# EAGLE design Virulent_HW (EAGLE 6.5.0)
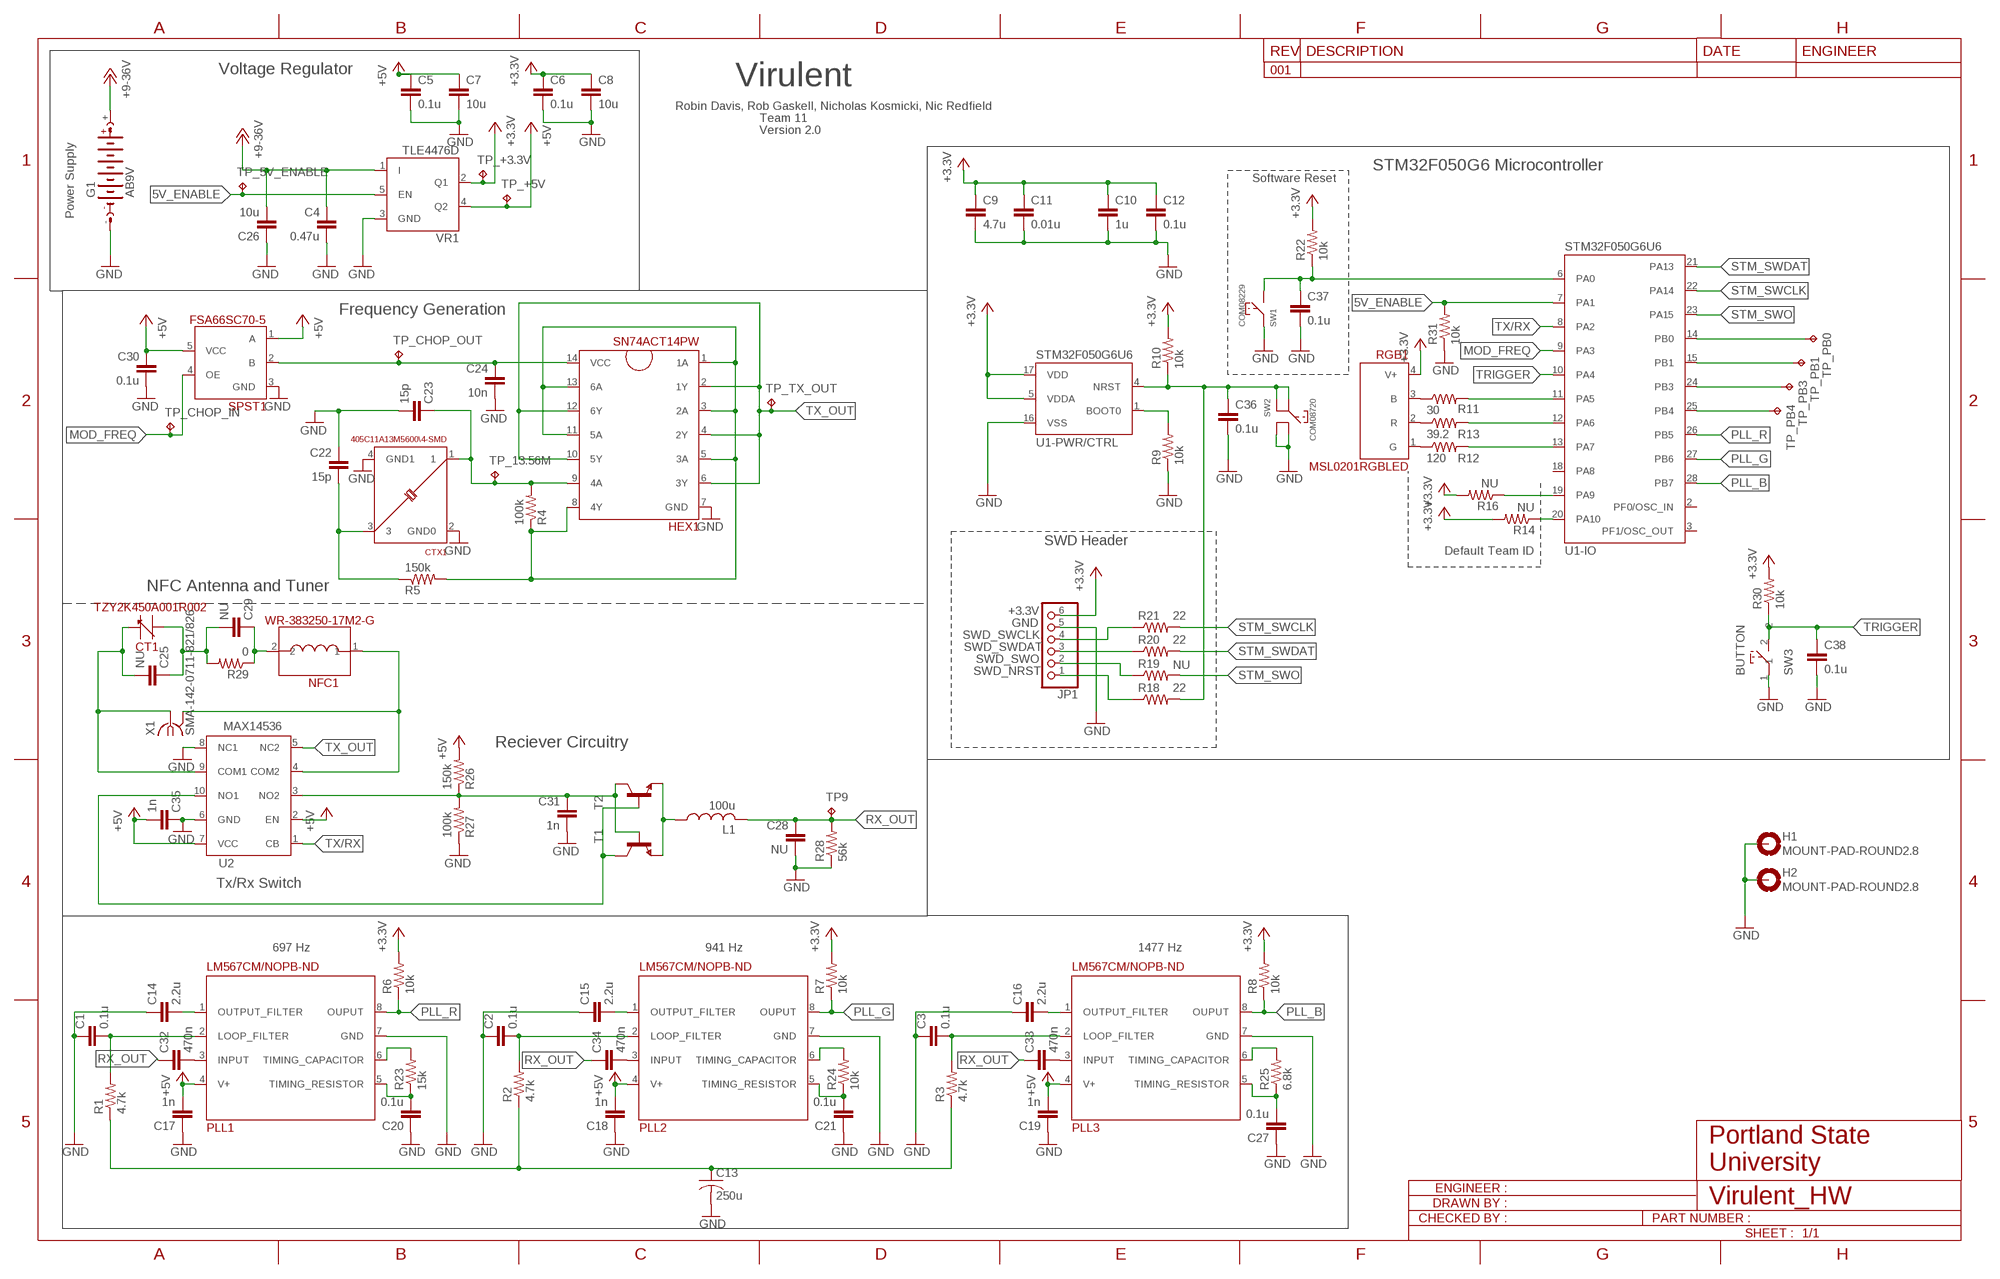
[diagram p0: schematic, sheet 1]

## Parts
C1  0.1u  C-EUC0402  [C0402]
C2  0.1u  C-EUC0402  [C0402]
C3  0.1u  C-EUC0402  [C0402]
C4  0.47u  C-EUC1206  [C1206]
C5  0.1u  C-EUC0402  [C0402]
C6  0.1u  C-EUC0402  [C0402]
C7  10u  C-EUC1206  [C1206]
C8  10u  C-EUC1206  [C1206]
C9  4.7u  C-EUC0805  [C0805]
C10  1u  C-EUC0805  [C0805]
C11  0.01u  C-EUC0402  [C0402]
C12  0.1u  C-EUC0402  [C0402]
C13  250u  C-USC1210  [C1210]
C14  2.2u  C-EUC0402  [C0402]
C15  2.2u  C-EUC0402  [C0402]
C16  2.2u  C-EUC0402  [C0402]
C17  1n  C-EUC0402  [C0402]
C18  1n  C-EUC0402  [C0402]
C19  1n  C-EUC0402  [C0402]
C20  0.1u  C-EUC0402  [C0402]
C21  0.1u  C-EUC0402  [C0402]
C22  15p  C-EUC0402  [C0402]
C23  15p  C-EUC0402  [C0402]
C24  10n  C-EUC0402  [C0402]
C25  NU  C-EUC0402  [C0402]
C26  10u  C-EUC1206  [C1206]
C27  0.1u  C-EUC0402  [C0402]
C28  NU  C-EUC0402  [C0402]
C29  NU  C-EUC0402  [C0402]
C30  0.1u  C-EUC0402  [C0402]
C31  1n  C-EUC0402  [C0402]
C32  470n  C-EUC0402  [C0402]
C33  470n  C-EUC0402  [C0402]
C34  470n  C-EUC0402  [C0402]
C35  1n  C-EUC0402  [C0402]
C36  0.1u  C-EUC0603  [C0603]
C37  0.1u  C-EUC0603  [C0603]
C38  0.1u  C-EUC0603  [C0603]
CT1  TZY2K450A001R002  [TZY2]
CTX1  405C11A13M5600\4-SMD  [4-SMD]
G1  AB9V  [AB9V]
H1  MOUNT-PAD-ROUND2.8  [2,8-PAD]
H2  MOUNT-PAD-ROUND2.8  [2,8-PAD]
HEX1  SN74ACT14PW  [TSSOP14]
JP1  PINHD-1X6  [1X06]
L1  100u  L-USL1008  [L1008]
NFC1  WR-383250-17M2-G  [17M2-G]
PLL1  LM567CM/NOPB-ND  [SOIC-8]
PLL2  LM567CM/NOPB-ND  [SOIC-8]
PLL3  LM567CM/NOPB-ND  [SOIC-8]
R1  4.7k  R-US_R0402  [R0402]
R2  4.7k  R-US_R0402  [R0402]
R3  4.7k  R-US_R0402  [R0402]
R4  100k  R-US_R0402  [R0402]
R5  150k  R-US_R0402  [R0402]
R6  10k  R-US_R0402  [R0402]
R7  10k  R-US_R0402  [R0402]
R8  10k  R-US_R0402  [R0402]
R9  10k  R-US_R0402  [R0402]
R10  10k  R-US_R0402  [R0402]
R11  30  R-US_R0402  [R0402]
R12  120  R-US_R0402  [R0402]
R13  39.2  R-US_R0402  [R0402]
R14  NU  R-US_R0402  [R0402]
R16  NU  R-US_R0402  [R0402]
R18  22  R-US_R0402  [R0402]
R19  NU  R-US_R0402  [R0402]
R20  22  R-US_R0402  [R0402]
R21  22  R-US_R0402  [R0402]
R22  10k  R-US_R0402  [R0402]
R23  15k  R-US_R0402  [R0402]
R24  10k  R-US_R0402  [R0402]
R25  6.8k  R-US_R0402  [R0402]
R26  150k  R-US_R0402  [R0402]
R27  100k  R-US_R0402  [R0402]
R28  56k  R-US_R0402  [R0402]
R29  0  R-US_R0402  [R0402]
R30  10k  R-US_R0402  [R0402]
R31  10k  R-US_R0402  [R0402]
RGB1  MSL0201RGBLED  [MSL0201RGB]
SPST1  FSA66SC70-5  [6-TSSOP]
SW1  COM08229  [COM08229]
SW2  COM08720  [COM08720]
SW3  BUTTON  [17M2-G]
T1  2N2222-NPN-TO18-EBC  [TO18]
T2  2N2222-NPN-TO18-EBC  [TO18]
TP9  TPTP06SQ  [TP06SQ]
TP_5V_ENABLE  TPTP06SQ  [TP06SQ]
TP_13.56M  TPTP06SQ  [TP06SQ]
TP_+3.3V  TPTP06SQ  [TP06SQ]
TP_+5V  TPTP06SQ  [TP06SQ]
TP_CHOP_IN  TPTP06SQ  [TP06SQ]
TP_CHOP_OUT  TPTP06SQ  [TP06SQ]
TP_PB0  TPTP06SQ  [TP06SQ]
TP_PB1  TPTP06SQ  [TP06SQ]
TP_PB3  TPTP06SQ  [TP06SQ]
TP_PB4  TPTP06SQ  [TP06SQ]
TP_TX_OUT  TPTP06SQ  [TP06SQ]
U1  STM32F050G6U6  [UQFPN-28]
U2  MAX14536  [10UTQFN]
VR1  TLE4476D  [PG-TO252-5-11]
X1  SMA-142-0711-821/826  [J502-ND-142-0711-821/826]

## Nets
5V_ENABLE: R31.2 TP_5V_ENABLE.TP U1.7(-IO:PA1) VR1.5(EN)
+2V: C31.1 R26.1 R27.2 T1.3(C) T2.2(B) U2.3(NO2)
+3.3V: C6.1 C8.1 C9.1 C10.1 C11.1 C12.1 JP1.6 R6.2 R7.2 R8.2 R10.2 R14.2 R16.2 R22.2 R30.2 RGB1.4(V+) TP_+3.3V.TP U1.5(-PWR/CTRL:VDDA) U1.17(-PWR/CTRL:VDD) VR1.2(Q1)
+5V: C5.1 C7.1 C17.2 C18.2 C19.2 C30.1 C35.2 PLL1.4(V+) PLL2.4(V+) PLL3.4(V+) R26.2 SPST1.1(A) SPST1.5(VCC) TP_+5V.TP U2.2(EN) U2.7(VCC) VR1.4(Q2)
+9-36V: C4.1 C26.2 G1.+ VR1.1(I)
CHOPPED_FREQ: C24.1 HEX1.14(VCC) SPST1.2(B) TP_CHOP_OUT.TP
GND: C1.1 C2.1 C3.1 C4.2 C5.2 C6.2 C7.2 C8.2 C9.2 C10.2 C11.2 C12.2 C13.2 C14.1 C15.1 C16.1 C17.1 C18.1 C19.1 C20.1 C21.1 C22.1 C23.2 C24.2 C26.1 C27.1 C28.2 C30.2 C31.2 C35.1 C36.2 C37.2 C38.2 CTX1.2(GND0) CTX1.4(GND1) G1.- H1.B2,8(MOUNT) H2.B2,8(MOUNT) HEX1.7(GND) JP1.5 PLL1.7(GND) PLL2.7(GND) PLL3.7(GND) R9.1 R27.1 R28.1 R31.1 SPST1.3(GND) SW1.1 SW2.3 SW2.4 SW3.1 U1.16(-PWR/CTRL:VSS) U2.6(GND) U2.8(NC1) VR1.3(GND)
MOD_FREQ: SPST1.4(OE) TP_CHOP_IN.TP U1.9(-IO:PA3)
N$1: C1.2 PLL1.2(LOOP_FILTER) R1.2
N$2: C2.2 PLL2.2(LOOP_FILTER) R2.2
N$3: C3.2 PLL3.2(LOOP_FILTER) R3.2
N$4: C13.1 R1.1 R2.1 R3.1
N$5: C14.2 PLL1.1(OUTPUT_FILTER)
N$6: C36.1 R10.1 R18.2 SW2.1 SW2.2 U1.4(-PWR/CTRL:NRST)
N$7: C16.2 PLL3.1(OUTPUT_FILTER)
N$8: C20.2 PLL1.5(TIMING_RESISTOR) R23.1
N$9: R9.2 U1.1(-PWR/CTRL:BOOT0)
N$10: C15.2 PLL2.1(OUTPUT_FILTER)
N$12: C21.2 PLL2.5(TIMING_RESISTOR) R24.1
N$13: PLL1.6(TIMING_CAPACITOR) R23.2
N$14: PLL2.6(TIMING_CAPACITOR) R24.2
N$16: C32.2 PLL1.3(INPUT)
N$17: C27.2 PLL3.5(TIMING_RESISTOR) R25.1
N$18: C23.1 CTX1.1 HEX1.9(4A) R4.2 TP_13.56M.TP
N$20: C25.2 CT1.2(B) U2.9(COM1) X1.1
N$21: R11.1 RGB1.3(B)
N$22: T1.2(B) T2.3(C) U2.10(NO1)
N$23: C34.2 PLL2.3(INPUT)
N$24: HEX1.1(1A) HEX1.3(2A) HEX1.5(3A) HEX1.8(4Y) HEX1.11(5A) HEX1.13(6A) R4.1 R5.2
N$25: C33.2 PLL3.3(INPUT)
N$26: C25.1 C29.2 CT1.1(A) R29.2
N$27: PLL3.6(TIMING_CAPACITOR) R25.2
N$28: R11.2 U1.11(-IO:PA5)
N$29: R13.2 U1.12(-IO:PA6)
N$30: C29.1 NFC1.2 R29.1
N$31: R12.2 U1.13(-IO:PA7)
N$32: NFC1.1 U2.4(COM2) X1.G@1 X1.G@2 X1.G@3 X1.G@4
N$33: C22.2 CTX1.3 R5.1
N$34: R16.1 U1.19(-IO:PA9)
N$35: R12.1 RGB1.1(G)
N$36: R13.1 RGB1.2(R)
N$41: TP_PB4.TP U1.25(-IO:PB4)
NRESET_SOFT: C37.1 R22.1 SW1.2 U1.6(-IO:PA0)
PB0: TP_PB0.TP U1.14(-IO:PB0)
PB1: TP_PB1.TP U1.15(-IO:PB1)
PB3: TP_PB3.TP U1.24(-IO:PB3)
PLL_B: PLL3.8(OUPUT) R8.1 U1.28(-IO:PB7)
PLL_G: PLL2.8(OUPUT) R7.1 U1.27(-IO:PB6)
PLL_R: PLL1.8(OUPUT) R6.1 U1.26(-IO:PB5)
RX_OUT: C28.1 C32.1 C33.1 C34.1 L1.2 R28.2 TP9.TP
RX_OUT_L: L1.1 T1.1(E) T2.1(E)
STM_SWCLK: R21.2 U1.22(-IO:PA14)
STM_SWDAT: R20.2 U1.21(-IO:PA13)
STM_SWO: R19.2 U1.23(-IO:PA15)
SWD_NRST: JP1.1 R18.1
SWD_SWCLK: JP1.4 R21.1
SWD_SWDAT: JP1.3 R20.1
SWD_SWO: JP1.2 R19.1
TEAMID1: R14.1 U1.20(-IO:PA10)
TRIGGER: C38.1 R30.1 SW3.2 U1.10(-IO:PA4)
TX/RX: U1.8(-IO:PA2) U2.1(CB)
TX_OUT: HEX1.2(1Y) HEX1.4(2Y) HEX1.6(3Y) HEX1.10(5Y) HEX1.12(6Y) TP_TX_OUT.TP U2.5(NC2)
Unconnected: U1.2(-IO:PF0/OSC_IN) U1.3(-IO:PF1/OSC_OUT) U1.18(-IO:PA8)

## Notes on the sheet
- Voltage Regulator
- Virulent
- Robin Davis, Rob Gaskell, Nicholas Kosmicki, Nic Redfield
- Team 11
- Version 2.0
- STM32F050G6 Microcontroller
- Software Reset
- Power Supply
- Frequency Generation
- SWD Header
- Default Team ID
- NFC Antenna and Tuner
- Reciever Circuitry
- Tx/Rx Switch
- 697 Hz | 941 Hz | 1477 Hz

## Library data of the parts
C1-C12 C14-C38 = rcl:C-EU: CAPACITOR, European symbol
C13 = rcl:C-US: CAPACITOR, American symbol
CT1 = Virulent_HW:TZY2K450A001R00
CTX1 = Virulent_HW:405C11A13M5600
G1 = battery:AB9V: 9-V BATTERY CLIP
H1 H2 = holes:MOUNT-PAD-ROUND: MOUNTING PAD, round
HEX1 = Virulent_HW:SN74ACT14
JP1 = Virulent_HW:PINHD-1X6: PIN HEADER
L1 = rcl:L-US: INDUCTOR, American symbol
NFC1 = Virulent_HW:WR-383250
PLL1-PLL3 = Virulent_HW:LM567CM
R1-R14 R16 R18-R31 = Virulent_HW:R-US_: RESISTOR, American symbol
RGB1 = Virulent_HW:MSL0201RGB
SPST1 = Virulent_HW:FSA66
SW1 = Virulent_HW:COM08229
SW2 = Virulent_HW:COM08720
SW3 = Virulent_HW:BUTTON
T1 T2 = transistor:*-NPN-: NPN Transistror BF959 corrected 2008.03.06
TP9 TP_5V_ENABLE TP_13.56M TP_+3.3V TP_+5V TP_CHOP_IN TP_CHOP_OUT TP_PB0 TP_PB1 TP_PB3 TP_PB4 TP_TX_OUT = testpad:TP: Test pad
U1 = Virulent_HW:STM32F050G6
U2 = Virulent_HW:MAX14536
VR1 = motorFeedback:TLE4476
X1 = con-coax:SMA-: SMA 50 Ohm End Launch Jack Receptacle - Round Contact Johnson Components Source: www.johnsoncomponents.com .. J502-ND.pdf; MF: JOHNSON COMPONENTS; MPN: 142-0711-821; OC_FARNELL: 1019328; OC_NEWARK: 16F3627

## Board
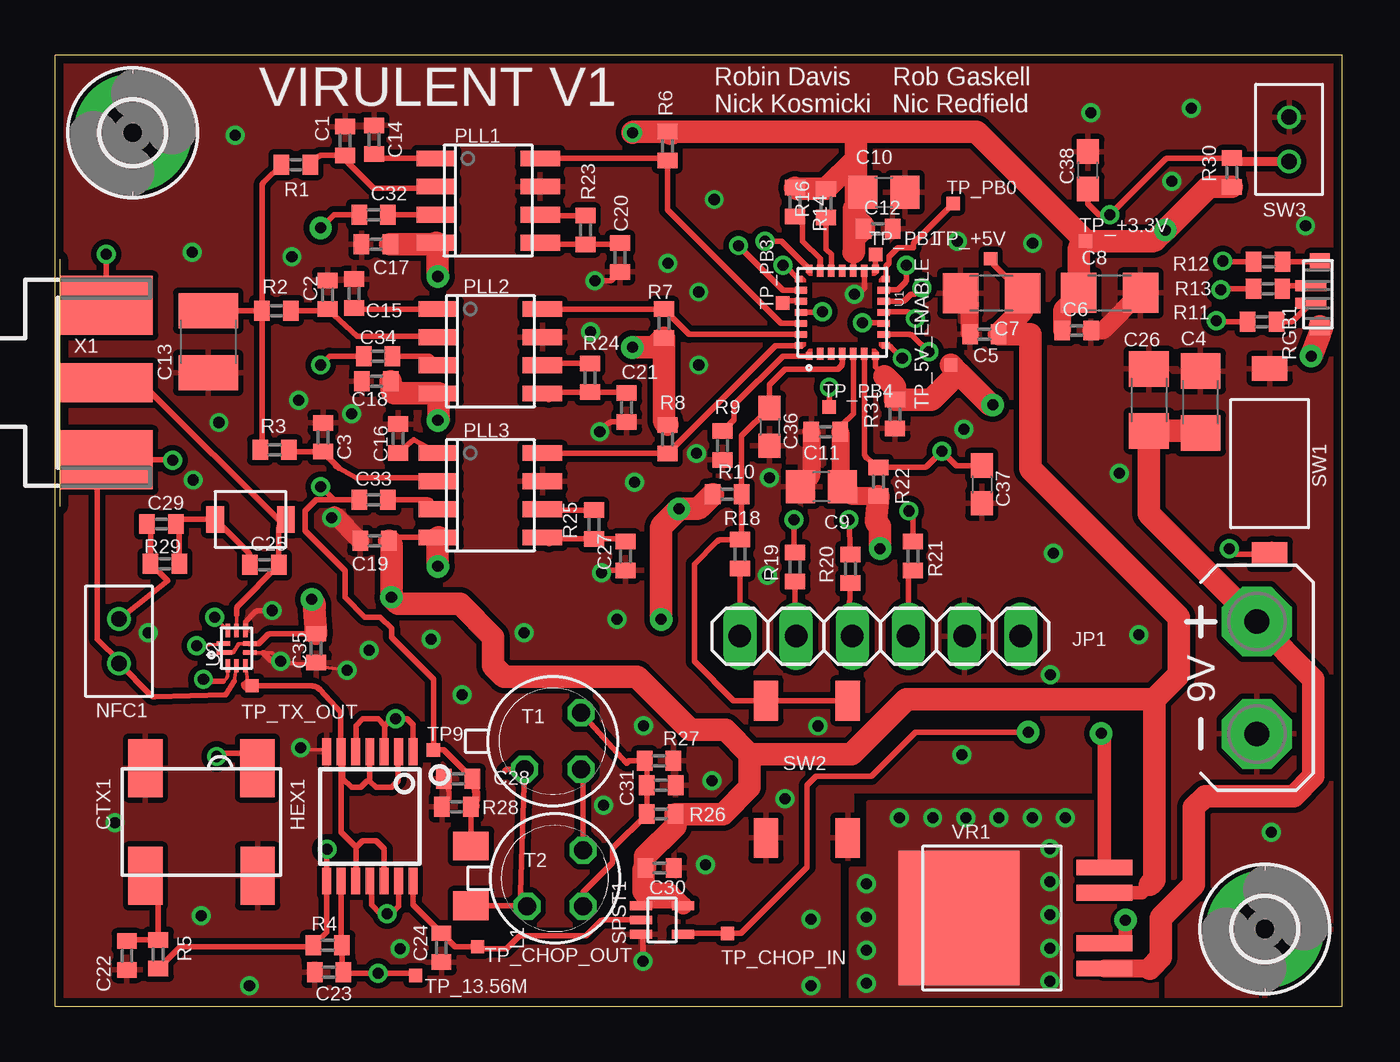
[diagram p1: board, top side]
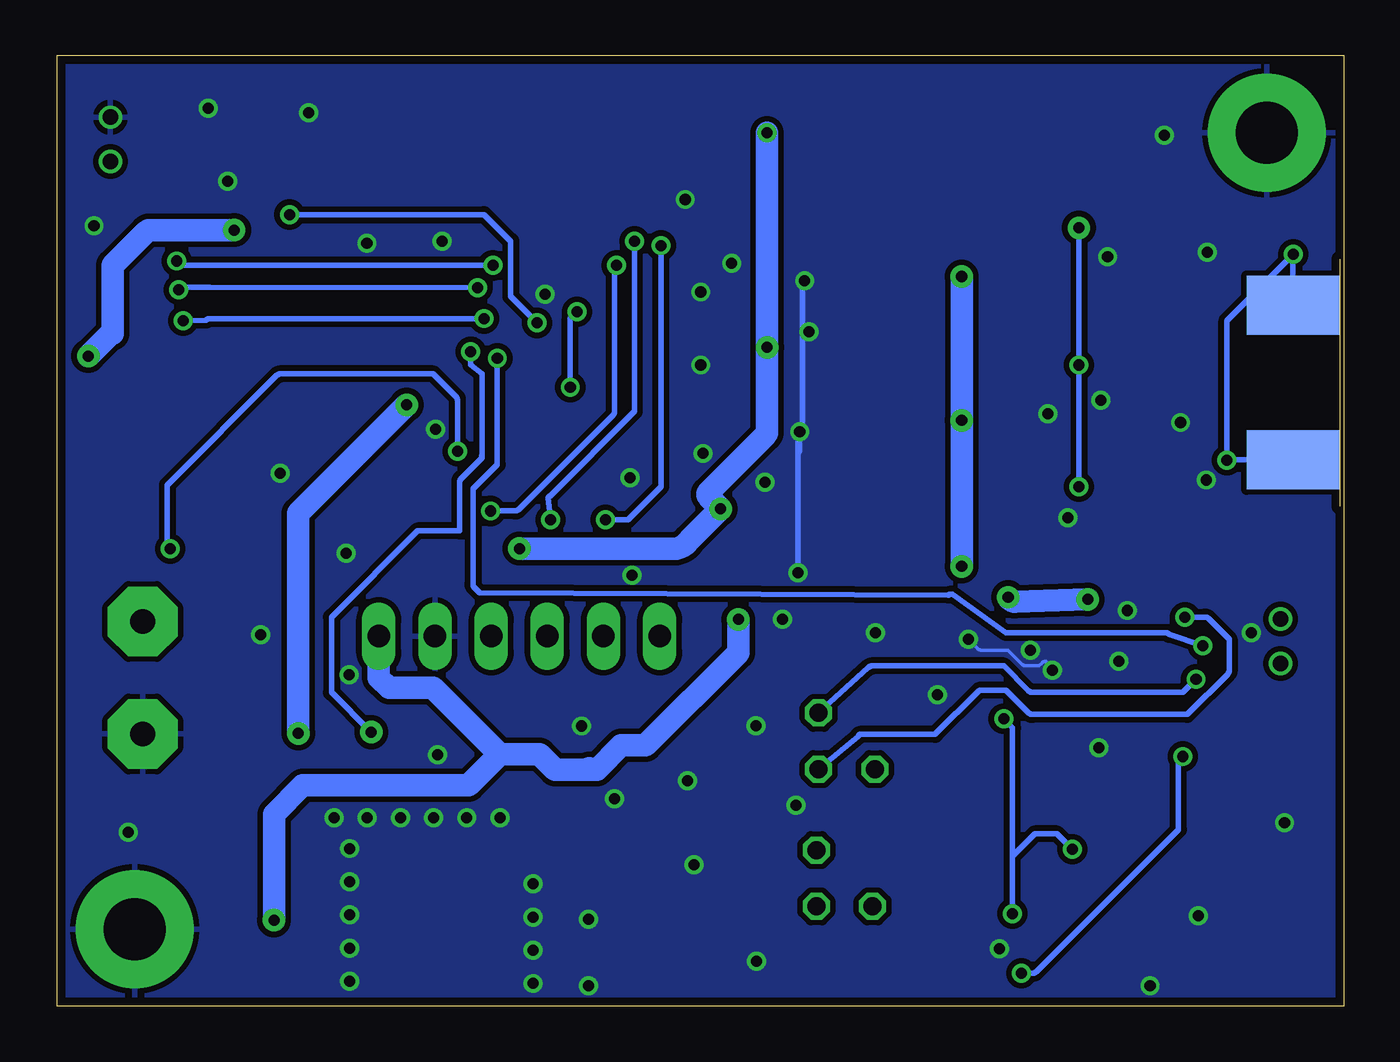
[diagram p2: board, bottom side, seen from below]

Size 58.2 x 43 mm. Coordinates in mm from the lower left corner, seen from the top.
Outline: 0,0 58.2,0 58.2,43 0,43 0,0
Copper layers (1*16): Top 0.0356mm / dielectric 1.5011mm / Bottom 0.0356mm
Design rules "LaenPCBOrder *": minimum track width 6mil, minimum drill 13mil, track to track 6mil, track to pad 6mil, pad to pad 6mil, via to via 6mil, smd to smd 6mil, copper to edge 15mil, drill to drill 6mil, minimum pad ring 7mil, minimum via ring 7mil, stop-mask expansion 3mil, vias tented up to drill 20mil, thermal gap 10mil

### Footprints (pad centres in the part's own frame; a part is rotated, then mirrored left to right if it is on the bottom)
C0402 = smd 0.7 x 0.9: 1 -0.65,0; 2 0.65,0
C1206 = smd 1.6 x 1.8: 1 -1.4,0; 2 1.4,0
C0805 = smd 1.3 x 1.5: 1 -0.95,0; 2 0.95,0
C1210 = smd 1.6 x 2.7: 1 -1.4,0; 2 1.4,0
C0603 = smd 1.1 x 1: 1 -0.85,0; 2 0.85,0
TZY2 = smd 0.8 x 1.2: 1 -1.6,0; 2 1.6,0
4-SMD = smd 1.55 x 2.618: 1 -2.535,-2.438; 2 2.535,-2.438; 3 2.535,2.438; 4 -2.54,2.438
AB9V = drill 1.118 pad 3.15 octagon: + 0,2.54; - 0,-2.54
2,8-PAD = drill 2.8 pad 5.334: B2,8 0,0
TSSOP14 = smd 0.4 x 1.2: 1 -2.275,-2.925; 2 -1.625,-2.925; 3 -0.975,-2.925; 4 -0.325,-2.925; 5 0.325,-2.925; 6 0.975,-2.925; 7 1.625,-2.925; 8 1.625,2.925; 9 0.975,2.925; 10 0.325,2.925; 11 -0.325,2.925; 12 -0.975,2.925; 13 -1.625,2.925; 14 -2.275,2.925
1X06 = drill 1.016 long: 1 -6.35,0; 2 -3.81,0; 3 -1.27,0; 4 1.27,0; 5 3.81,0; 6 6.35,0
L1008 = smd 1.3 x 1.6: 1 -1.35,0; 2 1.35,0
17M2-G = drill 0.7: 1 0,1; 2 0,-1
SOIC-8 = smd 0.711 x 1.778: 1 -1.905,-2.349; 2 -0.635,-2.349; 3 0.635,-2.349; 4 1.905,-2.349; 5 1.905,2.349; 6 0.635,2.349; 7 -0.635,2.349; 8 -1.905,2.349
R0402 = smd 0.7 x 0.9: 1 -0.65,0; 2 0.65,0
MSL0201RGB = smd 0.9 x 0.8: 1 -0.075,-1.45; 4 -0.075,1.45 | smd 1.4 x 0.5: 2 0.325,-0.4; 3 0.325,0.4
6-TSSOP = smd 1 x 0.4: 1 -0.95,0.65; 2 -0.95,0; 3 -0.95,-0.65; 4 0.95,-0.65; 5 0.95,0.65
COM08229 = smd 1.1 x 1.6: 1 -4.2,0; 2 4.2,0
COM08720 = smd 1.8 x 1.1: 1 -3.1,1.85; 2 -3.1,-1.85; 3 3.1,1.85; 4 3.1,-1.85
TO18 = drill 0.813 octagon: 1 -1.27,-1.27; 2 1.27,-1.27; 3 1.27,1.27
TP06SQ = smd 0.6 x 0.6: TP 0,0
UQFPN-28 = smd 0.35 x 0.3: 1 -1.975,1.5; 7 -1.975,-1.5; 15 1.975,-1.5; 21 1.975,1.5 | smd 0.55 x 0.3: 2 -1.875,1; 3 -1.875,0.5; 4 -1.875,0; 5 -1.875,-0.5; 6 -1.875,-1; 16 1.875,-1; 17 1.875,-0.5; 18 1.875,0; 19 1.875,0.5; 20 1.875,1 | smd 0.3 x 0.35: 8 -1.5,-1.975; 14 1.5,-1.975; 22 1.5,1.975; 28 -1.5,1.975 | smd 0.3 x 0.55: 9 -1,-1.875; 10 -0.5,-1.875; 11 0,-1.875; 12 0.5,-1.875; 13 1,-1.875; 23 1,1.875; 24 0.5,1.875; 25 0,1.875; 26 -0.5,1.875; 27 -1,1.875
10UTQFN = smd 0.2 x 0.6: 1 0.2,0.6; 6 -0.2,-0.6; 7 0.2,-0.6 | smd 0.2 x 0.7: 2 -0.2,0.55 | smd 0.6 x 0.2: 3 -0.8,0.4; 4 -0.8,0; 5 -0.8,-0.4; 8 0.8,-0.4; 9 0.8,0; 10 0.8,0.4
PG-TO252-5-11 = smd 0.711 x 2.54: 1 -2.286,-5.08; 2 -1.143,-5.08; 4 1.143,-5.08; 5 2.286,-5.08 | smd 6.096 x 5.461: 3 0,1.499
J502-ND-142-0711-821/826 = smd 4.191 x 1.778: 1 2.115,0 | smd 4.191 x 2.667: G@1 2.115,3.495; G@2 2.115,-3.495 | smd 4.191 x 2.667 bottom: G@3 2.115,3.495; G@4 2.115,-3.495

### Placement (x,y rotation side)
C1  13.11,39.13 270 top
C2  12.31,32.18 270 top
C3  12.11,25.73 270 top
C4  51.79,27.32 90 top
C5  42.02,30.39 180 top
C6  46.19,30.56 0 top
C7  42.34,32.24 180 top
C8  47.68,32.26 0 top
C9  34.65,23.49 180 top
C10  37.47,36.81 0 top
C11  34.84,25.99 180 top
C12  37.21,35.16 0 top
C13  6.92,30.05 270 top
C14  14.41,39.18 270 top
C15  13.51,32.23 270 top
C16  15.51,25.68 270 top
C17  14.5,34.46 0 top
C18  14.52,28.26 0 top
C19  14.44,21.06 0 top
C20  25.54,33.86 90 top
C21  25.84,27.08 90 top
C22  3.24,2.3 90 top
C23  12.38,1.54 180 top
C24  17.46,2.66 270 top
C25  9.46,19.96 0 top
C26  49.46,27.42 270 top
C27  25.79,20.36 90 top
C28  18.22,10.29 180 top
C29  4.8,21.81 0 top
C30  27.33,6.26 0 top
C31  27.4,10 0 top
C32  14.4,35.8 0 top
C33  14.4,22.9 0 top
C34  14.6,29.4 0 top
C35  11.8,16.2 90 top
C36  32.3,26.2 270 top
C37  41.9,23.6 270 top
C38  46.7,37.8 90 top
CT1  8.83,22.02 0 top
CTX1  6.61,8.34 180 top
G1  54.34,14.86 0 top
H1  54.7,3.5 0 top
H2  3.5,39.5 0 top
HEX1  13.9,8.59 180 top
JP1  37.31,16.74 0 top
L1  18.8,5.9 90 top
NFC1  2.88,16.51 180 top
PLL1  19.58,36.43 270 top
PLL2  19.68,29.62 270 top
PLL3  19.68,23.11 270 top
R1  10.88,38.06 0 top
R2  10,31.46 0 top
R3  9.92,25.16 0 top
R4  12.32,2.76 0 top
R5  4.66,2.36 270 top
R6  27.68,38.9 90 top
R7  27.52,30.88 270 top
R8  27.68,25.64 90 top
R9  30.18,25.36 90 top
R10  30.39,23.16 180 top
R11  54.57,30.96 180 top
R12  54.85,33.66 180 top
R13  54.84,32.44 180 top
R14  33.46,36.37 90 top
R16  34.86,36.31 90 top
R18  30.96,20.45 90 top
R19  33.46,19.87 90 top
R20  35.96,19.79 90 top
R21  38.78,20.36 90 top
R22  37.22,23.72 270 top
R23  23.98,35.1 90 top
R24  24.18,28.42 90 top
R25  24.36,21.79 90 top
R26  27.4,8.7 0 top
R27  27.3,11.1 180 top
R28  18.14,9.02 0 top
R29  4.96,20.02 0 top
R30  53.2,37.7 270 top
R31  37.98,26.78 90 top
RGB1  57.11,32.19 180 top
SPST1  27.44,3.91 0 top
SW1  54.92,24.64 270 top
SW2  33.99,10.72 270 top
SW3  55.8,39.2 0 top
T1  22.5,12 0 top
T2  22.6,5.8 0 top
TP9  17.1,11.6 0 top
TP_5V_ENABLE  40.5,29 0 top
TP_13.56M  16.3,1.4 0 top
TP_+3.3V  46.6,34.6 0 top
TP_+5V  42.3,33.8 0 top
TP_CHOP_IN  30.4,3.3 0 top
TP_CHOP_OUT  19.1,2.7 0 top
TP_PB0  40.6,36.3 0 top
TP_PB1  37.1,34 0 top
TP_PB3  32.9,31.8 90 top
TP_PB4  35,27.1 0 top
TP_TX_OUT  8.9,14.5 0 top
U1  35.59,31.38 90 top
U2  8.2,16.2 90 top
VR1  42.37,4 90 top
X1  0.2,28.2 0 top

### Tracks (layer width: path | path; a pad name or v marks a point on that pad's centre or on a via)
5V_ENABLE  (via drill 0.5 pad 1.02)
  Top 0.254: U1.7 37.09,28.91 37.5,28.5
  Top 0.61: VR1.5 47.45,12.2 v47.3,12.35
  Top 1.016: v42.4,27.2 42.3,27.2 40.85,28.65 | 40.85,28.65 TP_5V_ENABLE.TP | 40.85,28.65 39.63,27.43 R31.2 37.98,28.02 37.5,28.5
  Bottom 1.016: v47.3,12.35 47.3,22.3 v42.4,27.2
+2V  (via drill 0.5)
  Top 0.16: U2.3 7.8,15.01 arc-45 7.73,14.83 7.6,14.7
  Top 0.254: T1.3 25.84,11 25.94,11.1 R27.2 26.75,10.9 C31.1 R26.1 25.2,7.15 25.2,6.5 23.87,5.17 T2.2 | 7.6,14.7 6.91,14.7 arc-45 6.73,14.77 v6.7,14.8
  Bottom 0.254: v6.7,14.8 7.3,14.2 14.1,14.2 arc45 14.27,14.27 15.4,15.4 21.34,15.4 arc-45 21.51,15.33 T1.3 23.47,13.17 arc-45 23.3,13.1
+3.3V  (via drill 0.5, 0.5 pad 1.02)
  Top 0.254: U1.5 arc-45 36.1,29.48 36.1,26.8 35.56,26.26 arc45 35.49,26.09 C11.1 arc-45 35.5,25.97 | U1.17 36.09,34.09 36.1,34.1
  Top 0.61: VR1.2 48.4,2.86 v48.4,3.9
  Top 0.813: C6.1 45.54,31.41 arc-45 45.61,31.59 C8.1 46.28,34.27 arc-45 46.35,34.45 | 46.28,34.17 arc-45 46.35,34.35 | R22.2 36.12,23.07 arc-45 35.95,23.14 C9.1 35.57,23.52 arc-45 35.5,23.7 35.5,25.97
  Top 1.016: 36.12,35.9 C10.1 | 27.88,39.46 arc-45 27.7,39.53 R6.2 | v27.4,17.5 27.4,21.59 arc-45 27.47,21.77 v28.2,22.5 28.98,22.5 arc45 29.15,22.57 R10.2 | v37.3,20.7 37.3,21.7 37.19,21.81 arc-45 37.12,21.98 R22.2 | v26.1,29.8 26.98,29.8 arc45 27.16,29.87 R7.2 27.52,26.55 arc45 27.59,26.38 R8.2 | 46.28,34.17 arc-45 46.35,34.35 | C8.1 46.28,34.17 | 46.28,34.17 arc-45 46.35,34.35 | 46.35,34.35 TP_+3.3V.TP | TP_+3.3V.TP 49.59,34.6 arc45 49.77,34.67 v50.2,35.1 52.08,36.98 arc-45 52.26,37.05 R30.2 | v56.8,29.4 57.2,30.45 arc-45 57.27,30.63 57.19,30.72 RGB1.4 | R6.2 26.22,39.55 arc45 v26.1,39.5 | 36.12,35.9 36.12,35.7 | 36.12,35.7 36.12,34.12 36.1,34.1 | 36.46,35.16 36.2,34.9 36.3,34.9 C12.1 36.56,35.26 36.12,35.7 | TP_+3.3V.TP 41.65,39.55 36.2,39.55 | 36.2,39.55 R6.2 | 36.2,38.3 36.2,36.15 36.12,36.07 36.12,35.9 | 36.2,38.3 36.2,39.55 | R14.2 33.52,36.96 R16.2 36.2,38.3
  Bottom 1.016: 43.59,15.79 arc45 43.66,15.96 JP1.6 43.66,14.86 43.2,14.4 41.2,14.4 38.2,11.4 | 34.13,10.77 arc45 34.3,10.7 | v37.3,20.7 30.2,20.7 arc-45 29.63,21.07 v28.2,22.5 28.73,23.03 arc45 28.8,23.2 26.17,25.83 arc-45 26.1,26.01 v26.1,29.8 v26.1,39.5 | v50.2,35.1 53.99,35.1 arc-45 54.17,35.03 55.7,33.5 55.7,30.41 arc-45 55.86,30.34 v56.8,29.4 | v27.4,17.5 27.4,16 31.6,11.8 32.7,11.8 33.8,10.7 34.3,10.7 | 34.3,10.7 35.7,10.7 36.4,11.4 38.2,11.4 | 38.2,11.4 39.6,10 47.1,10 48.4,8.7 v48.4,3.9
+5V  (via drill 0.5 pad 1.02)
  Top 0.16: 8,16 U2.2 8.05,16 8.3,16.4 U2.7
  Top 0.254: C19.2 15.16,21.13 arc-45 15.34,21.2 PLL3.4 17.3,21.23 | 43.8,32.38 arc-45 C7.1 42.47,33.51 arc-45 42.4,33.69 TP_+5V.TP | U2.7 9.2,16.4 9.58,16.78 arc-45 9.76,16.85 C35.2 | SPST1.1 SPST1.5
  Top 0.61: VR1.4 49.14,5.14 49.5,5.5
  Top 0.813: SPST1.5 27.85,5.1 27.7,5.1
  Top 1.016: C17.2 17.07,34.46 arc45 PLL1.4 17.3,34.46 v17.3,33 | C18.2 15.24,27.79 arc45 15.42,27.71 PLL2.4 17.33,26.53 v17.3,26.5 | C19.2 15.13,21.02 arc-45 15.2,20.84 v15.2,18.5 15.5,18.2 18.3,18.2 19.8,16.7 19.8,15.4 20.3,14.9 26.3,14.9 28.7,12.5 30.3,12.5 31.4,11.4 | v11.6,18.4 11.73,18.17 arc-45 11.7,18 C35.2 | C7.1 43.74,31.57 arc-45 43.67,31.39 C5.1 44.1,30.39 44.1,24.3 50.8,17.6 50.8,15 49.7,13.9 | v17.3,19.9 17.3,21.17 PLL3.4 | 49.7,13.9 38.5,13.9 36,11.4 31.4,11.4 | 27.7,5.1 26.7,5.1 26.6,5.2 26.6,6.18 C30.1 26.68,6.78 28.05,8.15 R26.2 30.2,8.7 31.4,9.9 31.4,11.4 | 49.7,13.9 49.7,5.7 49.5,5.5
  Bottom 1.016: v15.2,18.5 15.07,18.37 arc-45 14.89,18.3 v11.6,18.4 | v17.3,19.9 v17.3,26.5 v17.3,33
+9-36V
  Top 0.813: 49.5,1.71 VR1.1
  Top 1.016: C4.1 51.69,26.02 C26.2 49.46,22.28 G1.+ 54.34,17.36 56.9,14.8 56.9,10.4 56,9.5 52,9.5 51.5,9 51.5,5.5 50,4 50,2.21 49.5,1.71
CHOPPED_FREQ
  Top 0.254: SPST1.2 24.82,3.91 arc45 24.64,3.84 24,3.2 21.11,3.2 arc45 20.93,3.13 20.4,2.6 19.3,2.6 arc-45 19.13,2.67 TP_CHOP_OUT.TP 18.07,2.7 C24.1 16.18,4.59 HEX1.14
GND  (via drill 0.5)
  Top 0.16: v11.1,11.7 11.1,11.6 12.09,11.6 arc-45 12.26,11.53 HEX1.7 | C35.1 arc-45 11.68,15.5 10.1,15.5 | 9.4,16 U2.6 9.7,16 arc-45 9.87,15.93 v10.2,15.6 v13.2,15.2
  Top 0.254: R28.1 17.79,9.34 arc45 C28.2 | C27.1 24.91,19.71 arc45 24.74,19.64 v24.7,19.6 | v24.4,32.8 25.02,32.8 arc45 25.2,32.87 C20.1 | C21.1 25.19,26.43 arc45 25.01,26.36 v24.63,25.97 | SPST1.3 26.51,3.24 arc-45 26.58,3.06 v26.58,2.04 | 9.4,16 9.73,15.67 arc45 9.9,15.6 v10.2,15.6 | U2.8 8.6,17.4 9.03,17.83 arc-45 9.21,17.9 v9.8,17.9 | U1.16 36.6,32.5 36.3,32.2 v36.14,32.2
  Top 0.813: C6.2 47.27,30.56 arc45 47.45,30.63 C8.2 | C5.2 41.37,31.7 arc45 41.3,31.88 C7.2 | C11.2 34.19,24.09 arc-45 34.12,23.91 C9.2 | C19.1 12.65,22.2 12.6,22.2 v12.5,22.1
  Top 1.016: C26.1 49.49,28.79 arc45 49.66,28.72
  Bottom 0.16: v13.2,15.2 13.49,15.6 arc-45 13.67,15.53 13.8,15.4 14.39,15.4 arc45 14.57,15.47 15.2,16.1 16.39,16.1 arc45 16.57,16.17 v17,16.6
  Bottom 0.254: v24.7,19.6 24.7,25 | 24.7,25 24.7,25.8 arc45 v24.63,25.97 | v24.63,25.97 24.5,26.1 24.5,32.59 arc45 24.43,32.77 v24.4,32.8 | v24.63,25.97 24.63,25.18 arc45 24.7,25
  other vias: 21.2,16.9 26.6,12.7 33,9.4 41,11.38 48.12,24.1 49,16.8 34.18,0.94 8.78,0.94 2.7,8.3 7.4,26.4 6.24,23.8 45.14,20.48 56.54,35.3 50.5,37.3 51.38,40.6 8.14,39.38 29.8,36.48 6.2,34.1 29.1,29 40.8,34.6 44.2,34.5 18.4,14.1 24.8,9.1 6.6,4.1 14.2,16.1 46.84,40.4 11,27.4 13.4,26.8 41.1,26.1 29,25 29.1,32.3 26.2,23.7 29.7,10.2 29.4,6.4 4.2,16.9 27.7,33.6 24.2,30.5 25.4,17.5 45,15 34.5,12.68 32.3,23.9 32.2,19.5 10.7,33.9 36.68,1.04 36.68,2.54 36.68,4.04 36.68,5.54 38.18,8.54 39.68,8.54 41.18,8.54 42.68,8.54 44.18,8.54 45.68,8.54 44.98,7.14 44.98,5.64 44.98,4.14 44.98,2.64 44.98,1.14 34.18,3.94 55,7.88 15.6,2.6
  pour Top (isolate 0.254): 0,0 35.4,0 35.4,6.7 36,6.7 36,9.75 50.3,9.75 50.3,0 58.2,0 58.2,42.9 0,42.9
  pour Bottom (isolate 0.254): 0,0 58.2,0 58.2,42.9 58.2,43 0,43
  pour Top (no thermals): 36,0 49.8,0 49.8,9.2 36.8,9.2 36.8,6.2 36,6.2
MOD_FREQ  (via drill 0.5, 0.5 pad 1.02)
  Top 0.254: SPST1.4 arc-45 28.49,3.3 TP_CHOP_IN.TP 31,3.3 34,6.3 34,10 34.4,10.4 36.9,10.4 38.9,12.4 v44,12.4 | v39.5,29.6 38.79,30.31 arc45 38.62,30.38 U1.9
  Bottom 0.254: v39.5,29.6 39.5,29 39,28.6 39,24.9 arc-90 39,24.8 39.93,23.87 arc-45 40,23.7 40,21.5 41.9,21.5 45.8,17.6 45.8,14.2 v44,12.4
N$1
  Top 0.254: PLL1.2 17.17,37 14.4,37 13.18,38.22 arc-45 13.11,38.4 C1.2 12.05,38.48 arc45 11.88,38.41 R1.2
N$2
  Top 0.254: PLL2.2 17.29,30.3 13.64,30.3 C2.2 12.44,31.46 R2.2
N$3
  Top 0.254: PLL3.2 17.16,23.57 arc-45 16.98,23.9 13.6,23.9 12.84,24.33 | 12.84,24.33 12.68,24.42 | R3.2 R3.2 arc45 10.76,25.08 C3.2 arc45 12.12,25.04 12.84,24.33
N$4
  Top 0.254: R2.1 9.35,25.68 arc45 9.42,25.51 R3.1 | C13.1 9.33,31.45 arc45 R2.1 | R2.1 9.35,37.08 arc-45 9.42,37.25 R1.1
N$5
  Top 0.254: PLL1.1 14.61,38.34 C14.2
N$6
  Top 0.254: U1.4 35.59,29.09 arc-45 35.52,28.92 35.4,28.8 33,28.8 32.3,28.1 C36.1 31.04,25.79 R10.1 31.04,21.18 R18.2 30.11,21.1 arc45 29.93,21.03 28.9,20 28.9,15.6 30.68,13.82 SW2.2 | SW2.1 SW2.2 | 32.14,14.21 SW2.2
N$7
  Top 0.254: C16.2 16.21,25.63 PLL3.1
N$8
  Top 0.254: PLL1.5 22.14,34.31 22.21,34.38 arc-45 22.39,34.45 R23.1 25.39,34.45 arc45 C20.2
N$9
  Top 0.254: U1.1 32.91,29.41 30.7,27.2 30.7,26.53 R9.2
N$10
  Top 0.254: PLL2.1 13.84,31.52 arc-45 C15.2
N$12
  Top 0.254: PLL2.5 22.31,27.43 22.58,27.7 arc-45 22.76,27.77 R24.1 25.54,27.77 arc-45 C21.2
N$13
  Top 0.254: PLL1.6 arc45 22.04,35.75 R23.2
N$14
  Top 0.254: PLL2.6 22.04,29 arc-45 22.22,29.07 R24.2
N$16
  Top 0.254: PLL1.3 C32.2
N$17
  Top 0.254: PLL3.5 22.32,20.91 22.48,21.07 arc-45 22.66,21.14 R25.1 25.36,21.14 arc-45 25.53,21.07 C27.2
N$18  (via drill 0.5)
  Top 0.254: HEX1.9 12.93,2.81 | R4.2 12.97,1.6 | CTX1.1 8.95,11.46 7.56,11.46 arc45 7.38,11.38 v7.3,11.3 | C23.1 13.07,1.5 v14.6,1.5 16.09,1.5 arc-45 16.27,1.43 TP_13.56M.TP
  Top 0.406: 12.93,2.81 R4.2 | 12.97,1.6 C23.1
  Bottom 0.254: v14.6,1.5 14.11,1.5 arc-45 13.93,1.57 7.5,8 7.5,10.99 | 7.5,10.99 arc45 7.43,11.17 v7.3,11.3 7.5,11.1 7.5,10.99
N$20
  Top 0.16: 8.2,17.7 U2.9
  Top 0.254: 10.18,21.77 arc45 10.11,21.59 C25.2 8.27,18.12 arc45 8.2,17.95 8.2,17.7 | 10.18,21.77 CT1.2 | 10.18,21.77 10.18,21.92 4.1,28 2.42,28 X1.1
N$21
  Top 0.254: R11.1 55.85,30.96 arc45 56.03,31.03 RGB1.3
N$22  (via drill 0.5)
  Top 0.16: U2.10 7.3,17.5
  Top 0.254: 7.3,17.5 v7.2,17.6 | T2.3 23.87,10.63 T1.2
  Bottom 0.254: v7.2,17.6 6.3,17.6 arc45 6.13,17.53 5.2,16.6 5.2,15.21 arc45 5.27,15.03 7.1,13.2 14.1,13.2 arc45 14.27,13.27 15.3,14.3 16.39,14.3 arc-45 16.57,14.23 18.5,12.3 21.89,12.3 arc-45 21.97,12.23 T1.2
N$23
  Top 0.254: 17.32,29 PLL2.3 16.99,29.33 arc45 16.81,29.4 C34.2
N$24  (via drill 0.5)
  Top 0.254: HEX1.5 13.6,11.54 13.6,12.7 13.9,13 14.6,13 14.9,12.7 | 14.9,12.7 14.9,11.57 arc-45 HEX1.3 | 14.9,12.7 15.2,13 v15.4,13 15.9,13 16.18,12.72 HEX1.1 | HEX1.13 15.53,4.53 15.2,4.2 v15,4.2 14.7,4.2 14.3,4.6 14.3,5.59 HEX1.11 | R4.1 12.28,3.37 HEX1.8 12.28,7.08 v12.3,7.1 | 11.61,2.7 5.65,2.7 R5.2
  Top 0.406: 11.61,2.7 R4.1
  Bottom 0.254: v15,4.2 15,6.8 | 15,6.8 15,12.6 v15.4,13 | v12.3,7.1 13,7.8 14,7.8 15,6.8
N$25
  Top 0.254: PLL3.3 16.98,22.83 arc45 16.8,22.9 C33.2
N$26
  Top 0.254: R29.2 5.61,21.65 C29.2 5.66,22.02 CT1.1 8.74,20.51 arc-45 8.81,20.34 C25.1
N$27
  Top 0.254: PLL3.6 arc45 22.11,22.44 R25.2
N$28  (via drill 0.5)
  Top 0.254: U1.11 arc-45 37.51,31.4 38.49,31.4 arc-45 38.67,31.33 v38.9,31.1 | v52.5,31 arc45 52.6,30.96 R11.2
  Bottom 0.254: v38.9,31.1 51.3,31.1 arc-45 51.47,31.03 v52.5,31
N$29  (via drill 0.5)
  Top 0.254: v52.7,32.4 52.79,32.4 arc-45 52.79,32.44 R13.2 | v39.2,32.5 38.97,32.27 arc-45 38.8,32.2 38.7,32.2 38.45,31.95 arc-45 38.27,31.88 U1.12
  Bottom 0.254: v39.2,32.5 51.3,32.51 52.49,32.51 arc-45 52.67,32.43 v52.7,32.4
N$30
  Top 0.254: C29.1 4.31,21.65 R29.1 5.08,19.25 NFC1.2
N$31  (via drill 0.5)
  Top 0.254: v38.5,33.5 38.5,32.91 arc-45 38.43,32.73 38.1,32.4 37.51,32.4 arc45 U1.13 | v52.8,33.7 arc45 53,33.66 R12.2
  Bottom 0.254: v38.5,33.5 52.6,33.5 v52.8,33.7
N$32  (via drill 0.5)
  Top 0.16: U2.4 8.1,14.7
  Top 0.254: 8.1,14.7 7.7,14.1 4.5,14 arc-45 4.32,14.07 NFC1.1 2.88,15.62 1.9,16.6 1.9,24.29 X1.G@2 v5.29,24.7 v5.3,24.7 | v2.3,34 2.3,31.71 X1.G@1
  Bottom 0.254: X1.G@1 2.31,33.98 v2.3,34 5.3,31 v5.3,24.7 v5.29,24.7 X1.G@2
N$33
  Top 0.254: 3.24,3.01 R5.1 4.66,5.69 CTX1.3
  Top 0.406: CTX1.3 4.66,6 | 3.24,3.01 C22.2
N$34
  Top 0.254: U1.19 arc45 35.1,33.28 35.1,34 34.86,34.24 R16.1
N$35
  Top 0.254: R12.1 57.14,33.66 arc-45 RGB1.1
N$36
  Top 0.254: RGB1.2 55.74,32.59 arc45 55.57,32.52 R13.1
N$41  (via drill 0.5)
  Top 0.254: U1.25 34.48,31.38 v34.7,31.4 | v35,28 TP_PB4.TP
  Bottom 0.254: v35,28 35,31.1 v34.7,31.4
NRESET_SOFT  (via drill 0.5)
  Top 0.254: U1.6 36.6,29.39 36.6,25 arc45 36.67,24.82 R22.1 39.27,24.37 arc45 39.44,24.44 v40.1,25.1 40.75,24.45 C37.1 | 55.02,20.9 arc45 SW1.2 53.47,20.44 arc-45 53.29,20.51 v53.1,20.7
  Bottom 0.254: v40.1,25.1 40.1,27.39 arc-45 40.17,27.57 41.2,28.6 48.09,28.6 arc-45 48.27,28.53 53.23,23.57 53.23,20.93 arc-45 53.15,20.75 v53.1,20.7
PB0
  Top 0.254: U1.14 37.56,33.47 37.7,33.6 37.7,33.9 38.1,34.3 38.8,34.3 38.8,34.5 TP_PB0.TP
PB1
  Top 0.254: U1.15 TP_PB1.TP
PB3
  Top 0.254: U1.24 33.7,31.9 33,31.9 TP_PB3.TP
PLL_B
  Top 0.254: PLL3.8 27.25,25.02 R8.1 32.57,29.88 U1.28
PLL_G
  Top 0.254: PLL2.8 27.43,31.52 R7.1 28.67,30.38 U1.27
PLL_R
  Top 0.254: PLL1.8 27.59,38.34 R6.1 27.68,36.02 32.82,30.88 U1.26
RX_OUT  (via drill 0.5, 0.5 pad 1.02)
  Top 0.254: C32.1 12.6,35.8 v12,35.2 | C34.1 12.4,29.4 v12,29 | v12,23.5 12.6,22.9 C33.1 11.8,22.9 11.3,22.4 11.3,21.5 13.1,19.7 13.1,18.5 14,17.6 14.7,17.6 15.2,17.1 15.2,16.7 17.1,14.8 TP9.TP 17.56,11.6 C28.1 | 19.07,9.04 C28.1 | C28.1 arc-45 19.09,9.34 R28.2 L1.2
  Bottom 0.254: v12,35.2 v12,29 v12,23.5
RX_OUT_L
  Top 0.254: 20.34,10.66 arc-45 20.52,10.73 T1.1 21.03,4.43 T2.1 21.31,4.55 L1.1
STM_SWCLK  (via drill 0.5)
  Top 0.254: v32.9,33.5 32.99,33.5 U1.22 | 38.6,21.06 arc-45 R21.2 38.78,22.11 arc45 38.71,22.29 v38.6,22.4
  Bottom 0.254: v32.9,33.5 33,33.4 33,26.91 arc45 33.07,26.73 37.33,22.47 arc45 37.51,22.4 v38.6,22.4
STM_SWDAT  (via drill 0.5)
  Top 0.254: R20.2 v35.9,22 | v32.1,34.6 32.84,34.6 U1.21
  Bottom 0.254: v32.1,34.6 32.1,26.9 35.93,23.07 arc-45 36,23 v35.9,22
STM_SWO  (via drill 0.5)
  Top 0.254: R19.2 33.4,20.66 v33.4,22 | v30.9,34.4 32.92,32.38 U1.23
  Bottom 0.254: v30.9,34.4 30.9,23.5 32.4,22 v33.4,22
SWD_NRST
  Top 0.254: JP1.1 R18.1
SWD_SWCLK
  Top 0.254: R21.1 38.65,19.58 arc45 38.58,19.41 JP1.4
SWD_SWDAT
  Top 0.254: JP1.3 36.06,16.76 35.93,16.89 arc-45 35.86,17.07 R20.1
SWD_SWO
  Top 0.254: JP1.2 33.46,16.78 R19.1
TEAMID1
  Top 0.254: 34.6,33.7 34.6,33.28 arc-45 U1.20 34.59,33.79 34.6,33.8 33.8,34.6 33.8,35.38 R14.1
TRIGGER  (via drill 0.5)
  Top 0.254: 53.45,38.2 arc-45 53.28,38.27 R30.1 50.35,38.35 arc45 50.18,38.28 v47.7,35.8 47.2,35.8 46.7,36.3 C38.1 | v36.5,30.9 37.42,30.9 arc-45 U1.10
  Top 0.406: 53.45,38.2 SW3.2
  Bottom 0.254: v47.7,35.8 38.9,35.8 37.7,34.6 37.7,32.1 v36.5,30.9
TX/RX  (via drill 0.5)
  Top 0.16: U2.1 v6.4,16.3 | 37.52,29.93 U1.8 arc45 37.38,29.95
  Top 0.254: v38.3,29.3 37.79,29.81 arc45 37.62,29.88 U1.8
  Bottom 0.254: v6.4,16.3 7.93,16.83 arc-45 8.11,16.9 15.3,16.9 17.73,18.63 arc-45 17.91,18.6 39.1,18.7 39.33,18.93 arc45 39.4,19.11 39.4,23.4 38.3,24.5 v38.3,29.3
TX_OUT
  Top 0.16: 8.7,14.7 U2.5
  Top 0.254: 13.6,7.2 12.93,7.88 HEX1.6 | HEX1.10 13.6,5.69 13.6,7.2 | 13.6,7.2 13.9,7.5 14.5,7.5 14.88,7.12 HEX1.12 | HEX1.2 15.5,11.49 15.5,10.2 15.2,9.9 14.5,9.9 14.22,10.18 | 14.22,10.18 HEX1.4 | HEX1.6 13,11.44 13,10.3 13.4,9.9 13.8,9.9 14.07,10.18 14.22,10.18 | HEX1.6 arc-45 12.9,11.57 12.9,13.3 11.97,14.33 arc45 11.49,14.5 TP_TX_OUT.TP 8.61,14.4 arc-45 8.53,14.57 8.7,14.7

### Text on the board
tPlace: VIRULENT V1 | Robin Davis Rob Gaskell / Nick Kosmicki Nic Redfield